# Altium schematic sheet base_tiempo.SchDoc: Base de tiempo
size A4; Revision: 1
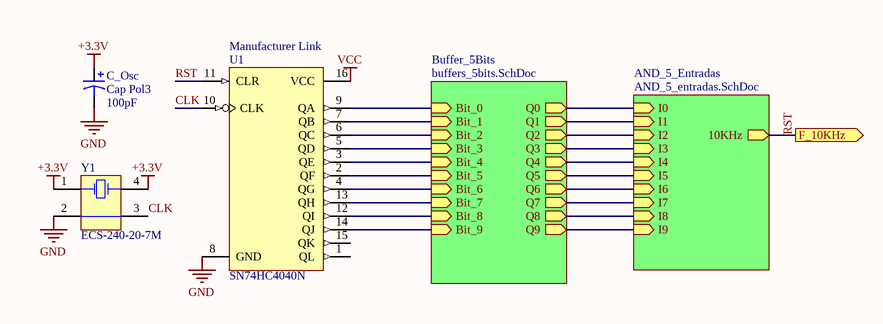
[diagram p0: base_tiempo.SchDoc]

## Parts
C_Osc  Cap Pol3  value 100pF  [C0805]
U1  SN74HC4040N  ComponentLink1Description: Manufacturer Link  [N016]
Y1  ECS-240-20-7M  [ECX-3M]

## Sub-sheets
AND_5_Entradas = AND_5_entradas.SchDoc: I0 (in), I1 (in), I2 (in), I3 (in), I4 (in), 10KHz (out), I5 (in), I6 (in), I7 (in), I8 (in), I9 (in)
Buffer_5Bits = buffers_5bits.SchDoc: Bit_0 (in), Bit_1 (in), Bit_2 (in), Bit_3 (in), Bit_4 (in), Q0 (out), Q1 (out), Q2 (out), Q3 (out), Q4 (out), Bit_5 (in), Bit_6 (in), Bit_7 (in), Bit_8 (in), Bit_9 (in), Q5 (out), Q6 (out), Q7 (out), Q8 (out), Q9 (out)

## Ports
F_10KHz (out)

## Nets
+3.3V: C_Osc.1 Y1.1(OSC1) Y1.4(OSC2)
GND: C_Osc.2 U1.8(GND) Y1.2(COM)
VCC: U1.16(VCC)
CLK: U1.10(CLK) Y1.3(COM)
RST: U1.11(CLR) ; port F_10KHz, sheet AND_5_Entradas/10KHz
NetU1_2: U1.2(QF) ; sheet Buffer_5Bits/Bit_5
NetU1_3: U1.3(QE) ; sheet Buffer_5Bits/Bit_4
NetU1_4: U1.4(QG) ; sheet Buffer_5Bits/Bit_6
NetU1_5: U1.5(QD) ; sheet Buffer_5Bits/Bit_3
NetU1_6: U1.6(QC) ; sheet Buffer_5Bits/Bit_2
NetU1_7: U1.7(QB) ; sheet Buffer_5Bits/Bit_1
NetU1_9: U1.9(QA) ; sheet Buffer_5Bits/Bit_0
NetU1_12: U1.12(QI) ; sheet Buffer_5Bits/Bit_8
NetU1_13: U1.13(QH) ; sheet Buffer_5Bits/Bit_7
NetU1_14: U1.14(QJ) ; sheet Buffer_5Bits/Bit_9
(unnamed): sheet Buffer_5Bits/Q0, sheet AND_5_Entradas/I0
(unnamed): sheet Buffer_5Bits/Q1, sheet AND_5_Entradas/I1
(unnamed): sheet Buffer_5Bits/Q2, sheet AND_5_Entradas/I2
(unnamed): sheet Buffer_5Bits/Q3, sheet AND_5_Entradas/I3
(unnamed): sheet Buffer_5Bits/Q4, sheet AND_5_Entradas/I4
(unnamed): sheet Buffer_5Bits/Q5, sheet AND_5_Entradas/I5
(unnamed): sheet Buffer_5Bits/Q6, sheet AND_5_Entradas/I6
(unnamed): sheet Buffer_5Bits/Q7, sheet AND_5_Entradas/I7
(unnamed): sheet Buffer_5Bits/Q8, sheet AND_5_Entradas/I8
(unnamed): sheet Buffer_5Bits/Q9, sheet AND_5_Entradas/I9

Not connected (* = marked no-connect by the designer): U1 1(QL) 15(QK)

## Library data of the parts
C_Osc = Cap Pol3: Polarized Capacitor (Surface Mount); Published: 8-Jun-2000; LatestRevisionDate: 17-Jul-2002; LatestRevisionNote: Re-released for DXP Platform.; PackageReference: C0805; Publisher: Altium Limited
U1 = SN74HC4040N: 12-Bit Asynchronous Binary Counter; Published: 8-Jun-2000; LatestRevisionDate: 04-Mar-2005; LatestRevisionNote: Stylized 3D Model Added.; DatasheetVersion: May-1997; PackageVersion: Oct-1995; PackageReference: N016; Publisher: Altium Limited; PackageDescription: DIP; 16 Leads; Row Spacing 7.62 mm; Pitch 2.54 mm; Code_JEDEC: MS-001-BB; ComponentLink1URL: http://www.ti.com/; ComponentLink2Description: Datasheet; ComponentLink2URL: http://www-s.ti.com/sc/ds/sn74hc4040.pdf
Y1 = ECS-240-20-7M: Crystal Oscillator; Published: 17-Jul-2002; DatasheetDocument: 18-Apr-2000; PackageReference: ECX-3M; Publisher: Altium Limited; ComponentLink1Description: Manufacturer Link; ComponentLink1URL: http://www.ecsxtal.com/